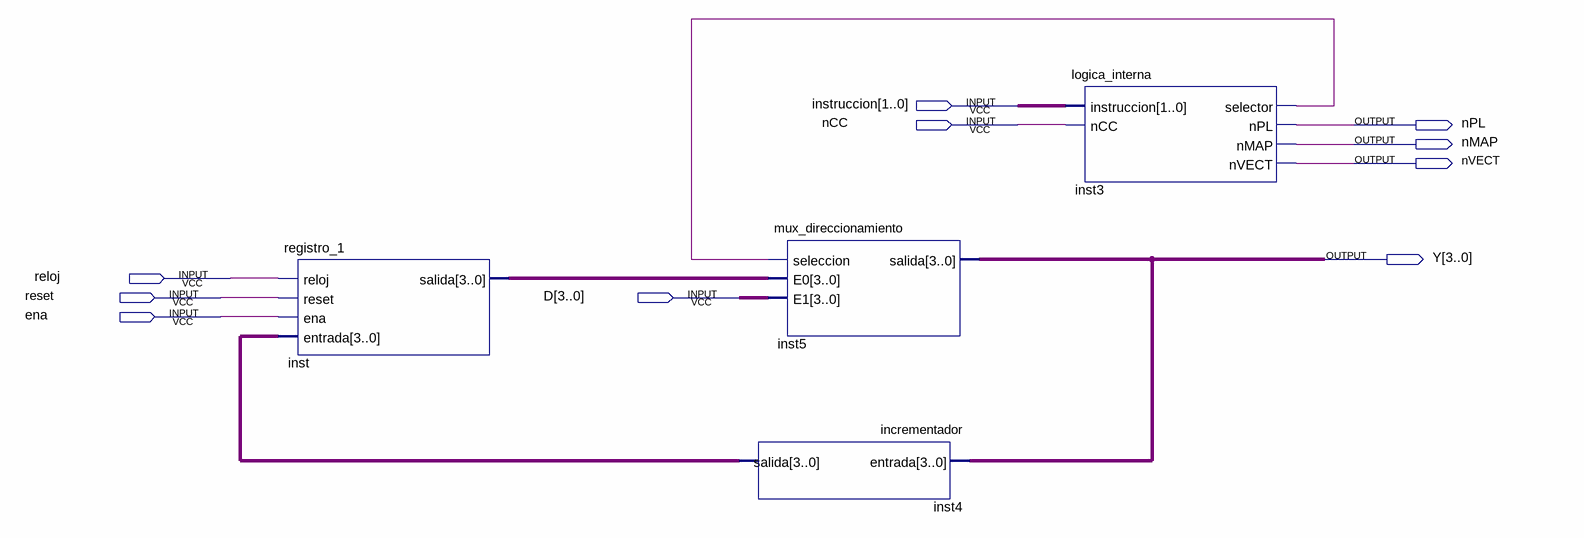
[diagram p0: schematic sheet]
// Quartus schematic secuenciador.bdf as structural Verilog: 4 symbols, 10 pins
module secuenciador (
  input  [1:0] instruccion,
  input  nCC,
  input  reloj,
  input  reset,
  input  [3:0] D,
  input  ena,
  output nPL,
  output nMAP,
  output nVECT,
  output [3:0] Y
);

  wire inst3_selector;
  wire [3:0] inst4_salida, inst_salida;

  registro_1 inst (.reloj(reloj), .reset(reset), .ena(ena), .entrada(inst4_salida), .salida(inst_salida));
  incrementador inst4 (.entrada(Y), .salida(inst4_salida));
  mux_direccionamiento inst5 (.seleccion(inst3_selector), .E0(inst_salida), .E1(D), .salida(Y));
  logica_interna inst3 (
    .instruccion(instruccion), .nCC(nCC), .selector(inst3_selector), .nPL(nPL), .nMAP(nMAP), .nVECT(nVECT));
endmodule
